# Altium schematic sheet SheetMain.SchDoc
size A3
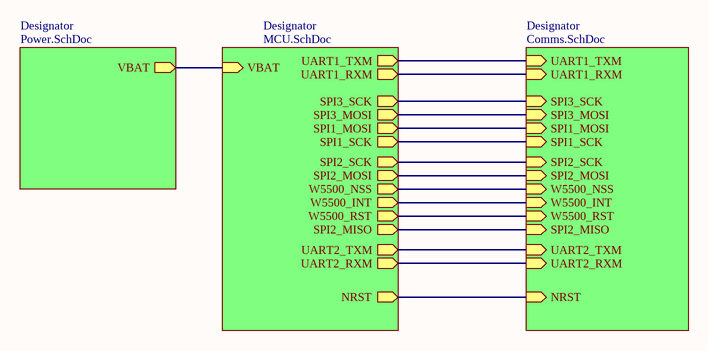
[diagram p0: SheetMain.SchDoc]

## Sub-sheets
Designator = Power.SchDoc: VBAT (out)
Designator = Comms.SchDoc: UART1_TXM (in), W5500_INT (in), W5500_RST (in), UART2_TXM (in), NRST (in), W5500_NSS (in), UART1_RXM (in), SPI1_MOSI (in), SPI3_MOSI (in), SPI2_MISO (in), SPI2_MOSI (in), SPI3_SCK (in), SPI1_SCK (in), SPI2_SCK (in), UART2_RXM (in)
Designator = MCU.SchDoc: W5500_NSS (out), UART1_RXM (out), W5500_INT (out), SPI3_SCK (out), SPI2_MISO (out), W5500_RST (out), UART1_TXM (out), NRST (out), VBAT (in), SPI1_SCK (out), SPI2_SCK (out), UART2_RXM (out), SPI2_MOSI (out), UART2_TXM (out), SPI1_MOSI (out), SPI3_MOSI (out)

## Nets
(unnamed): sheet Designator/VBAT, sheet Designator/VBAT
(unnamed): sheet Designator/UART1_TXM, sheet Designator/UART1_TXM
(unnamed): sheet Designator/W5500_INT, sheet Designator/W5500_INT
(unnamed): sheet Designator/W5500_RST, sheet Designator/W5500_RST
(unnamed): sheet Designator/UART2_TXM, sheet Designator/UART2_TXM
(unnamed): sheet Designator/NRST, sheet Designator/NRST
(unnamed): sheet Designator/W5500_NSS, sheet Designator/W5500_NSS
(unnamed): sheet Designator/UART1_RXM, sheet Designator/UART1_RXM
(unnamed): sheet Designator/SPI1_MOSI, sheet Designator/SPI1_MOSI
(unnamed): sheet Designator/SPI3_MOSI, sheet Designator/SPI3_MOSI
(unnamed): sheet Designator/SPI2_MISO, sheet Designator/SPI2_MISO
(unnamed): sheet Designator/SPI2_MOSI, sheet Designator/SPI2_MOSI
(unnamed): sheet Designator/SPI3_SCK, sheet Designator/SPI3_SCK
(unnamed): sheet Designator/SPI1_SCK, sheet Designator/SPI1_SCK
(unnamed): sheet Designator/SPI2_SCK, sheet Designator/SPI2_SCK
(unnamed): sheet Designator/UART2_RXM, sheet Designator/UART2_RXM